# EAGLE design tenacity_pcb (EAGLE 9.6.2)
REV: p1; TITLE: Elemental Tenacity
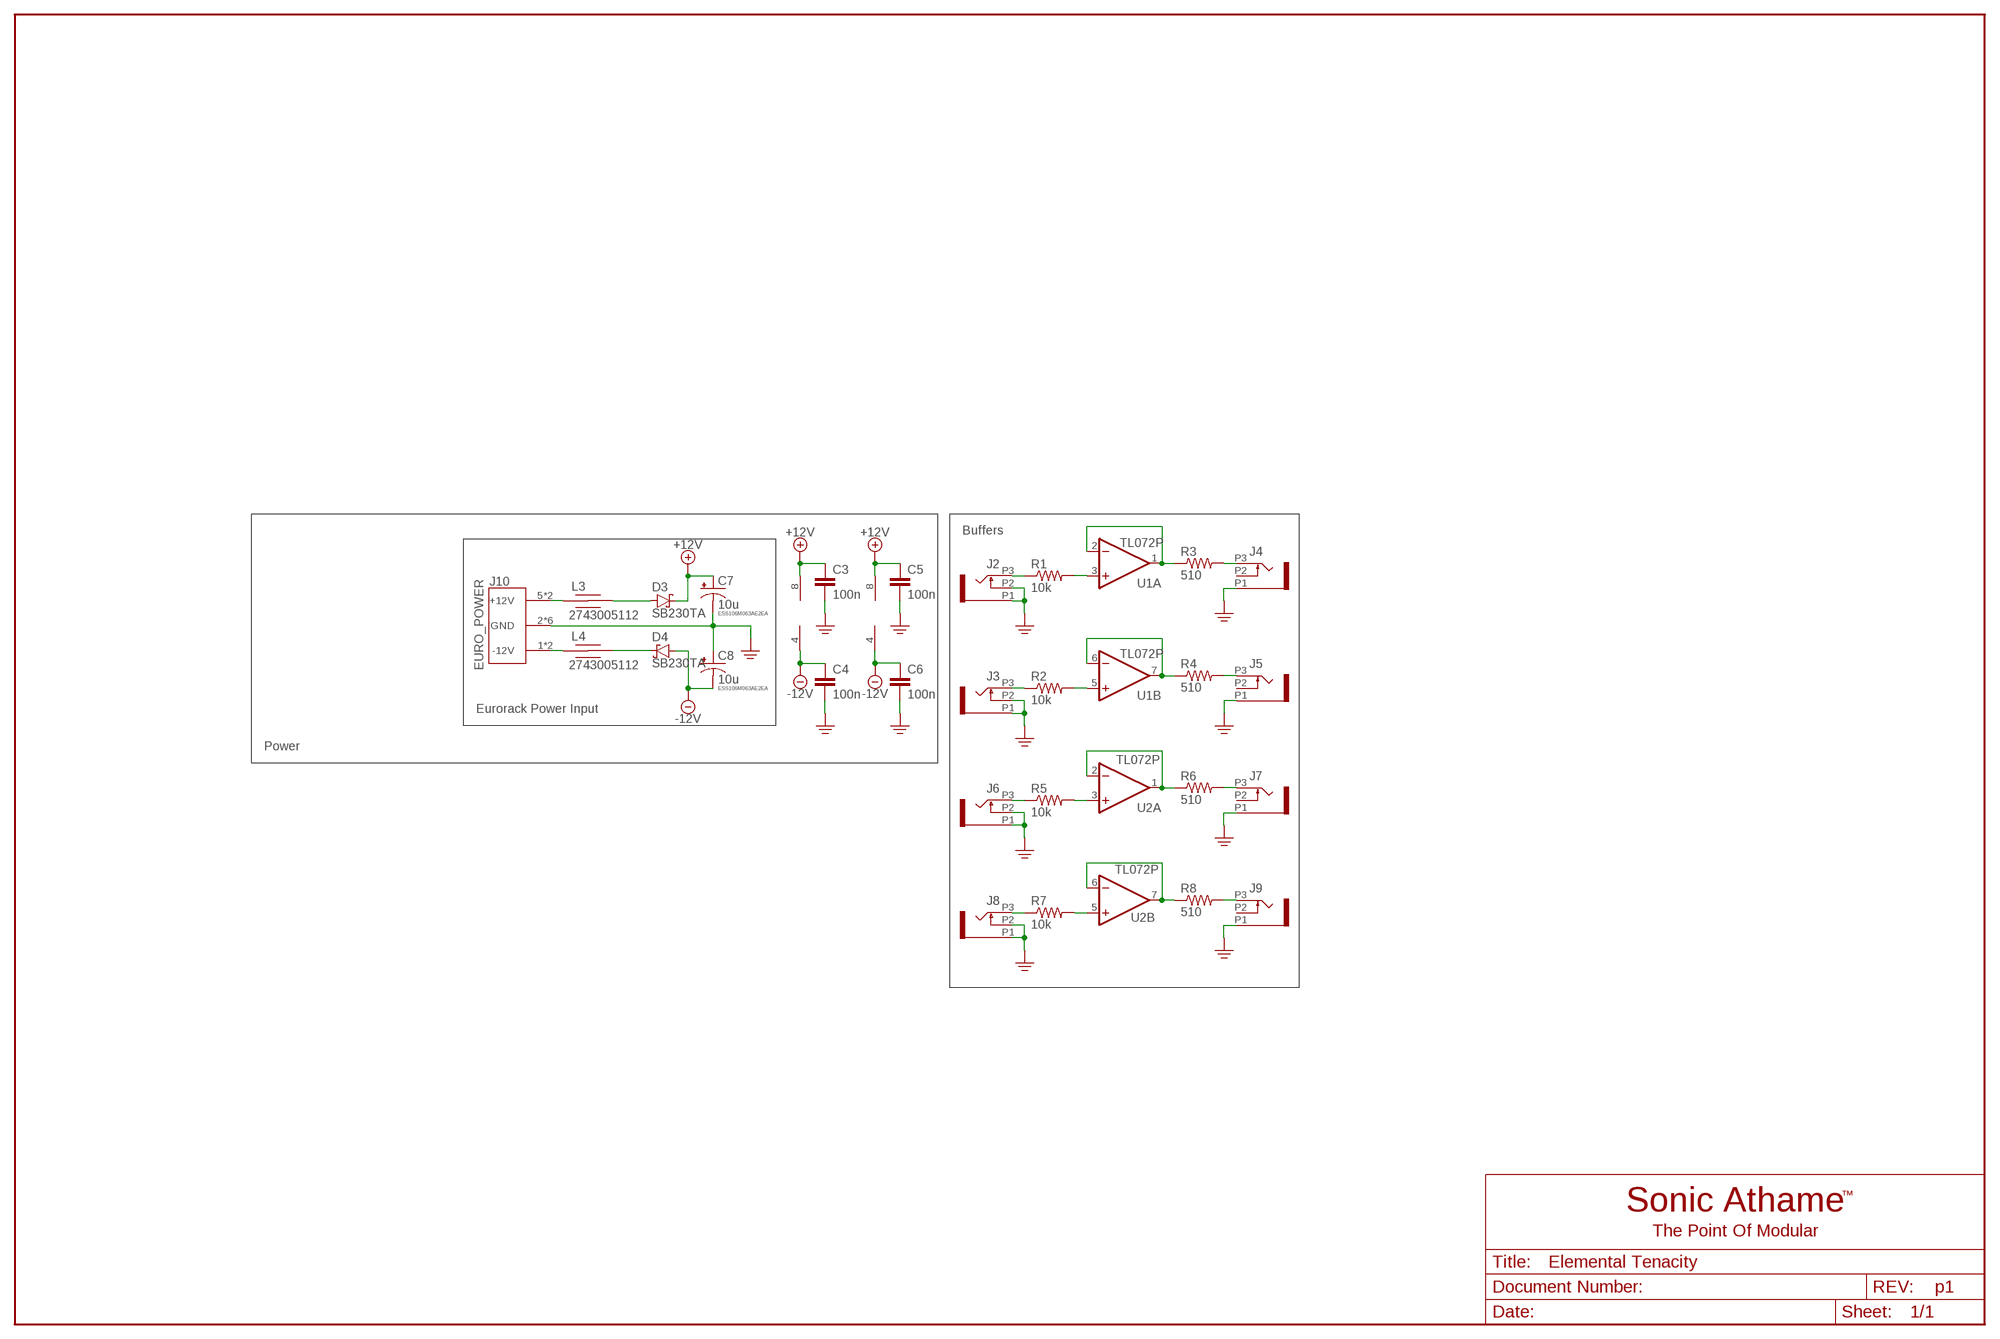
[diagram p0: schematic, sheet 1]

## Parts
C3  100n  CAP_NONPOL025-024X044  [C025-024X044]
C4  100n  CAP_NONPOL025-024X044  [C025-024X044]
C5  100n  CAP_NONPOL025-024X044  [C025-024X044]
C6  100n  CAP_NONPOL025-024X044  [C025-024X044]
C7  10u  CAP_POLLYTIC_V  [TT2D5]
C8  10u  CAP_POLLYTIC_V  [TT2D5]
D3  SB230TA  SCHOTTKY_THT  [0207/2V-POL]
D4  SB230TA  SCHOTTKY_THT  [0207/2V-POL]
J2  WQP-PJ398SM6  [WQP_PJ_301M6]
J3  WQP-PJ398SM6  [WQP_PJ_301M6]
J4  WQP-PJ398SM6  [WQP_PJ_301M6]
J5  WQP-PJ398SM6  [WQP_PJ_301M6]
J6  WQP-PJ398SM6  [WQP_PJ_301M6]
J7  WQP-PJ398SM6  [WQP_PJ_301M6]
J8  WQP-PJ398SM6  [WQP_PJ_301M6]
J9  WQP-PJ398SM6  [WQP_PJ_301M6]
J10  EURO_POWER  [EURO_POWER]
L3  2743005112  FERRITE_THT  [0207/2V]
L4  2743005112  FERRITE_THT  [0207/2V]
R1  10k  RESISTOR0207/2V  [0207/2V]
R2  10k  RESISTOR0207/2V  [0207/2V]
R3  510  RESISTOR0207/2V  [0207/2V]
R4  510  RESISTOR0207/2V  [0207/2V]
R5  10k  RESISTOR0207/2V  [0207/2V]
R6  510  RESISTOR0207/2V  [0207/2V]
R7  10k  RESISTOR0207/2V  [0207/2V]
R8  510  RESISTOR0207/2V  [0207/2V]
U1  TL072P  [DIL08]
U2  TL072P  [DIL08]

## Nets
+12V: C3.1 C5.1 C7.+ D3.C U1.8(P:V+) U2.8(P:V+)
-12V: C4.1 C6.1 C8.- D4.A U1.4(P:V-) U2.4(P:V-)
GND: C3.2 C4.2 C5.2 C6.2 C7.- C8.+ J2.P1 J2.P2 J3.P1 J3.P2 J4.P1 J5.P1 J6.P1 J6.P2 J7.P1 J8.P1 J8.P2 J9.P1 J10.2(GND) J10.3(GND) J10.4(GND) J10.7(GND) J10.8(GND) J10.9(GND)
N$1: J8.P3 R7.1
N$2: R7.2 U2.5(B:+IN)
N$3: R1.2 U1.3(A:+IN)
N$4: J2.P3 R1.1
N$5: J5.P3 R4.2
N$6: J4.P3 R3.2
N$7: R2.2 U1.5(B:+IN)
N$8: J9.P3 R8.2
N$9: J7.P3 R6.2
N$10: R4.1 U1.6(B:-IN) U1.7(B:OUT)
N$11: J3.P3 R2.1
N$12: R3.1 U1.1(A:OUT) U1.2(A:-IN)
N$13: R8.1 U2.6(B:-IN) U2.7(B:OUT)
N$14: J6.P3 R5.1
N$15: R5.2 U2.3(A:+IN)
N$16: R6.1 U2.1(A:OUT) U2.2(A:-IN)
N$21: D3.A L3.2
N$22: D4.C L4.2
N$23: J10.1(-12V) J10.10(-12V) L4.1
N$24: J10.5(+12V) J10.6(+12V) L3.1
Unconnected: J4.P2 J5.P2 J7.P2 J9.P2

## Notes on the sheet
- Buffers
- ESS106M063AE2EA
- ESS106M063AE2EA
- Eurorack Power Input
- Power

## Library data of the parts
C3-C6 = SonicAthame:CAP_NONPOL: CAPACITOR, European symbol; SPICEPREFIX: C
C7 C8 = SonicAthame:CAP_POL: POLARIZED CAPACITOR, American symbol
D3 D4 = SonicAthame:SCHOTTKY: THT: SB230TA
J2-J9 = SonicAthame:WQP-PJ398SM
J10 = SonicAthame:EURO_POWER
L3 L4 = SonicAthame:FERRITE
R1-R8 = SonicAthame:RESISTOR: RESISTOR, American symbol; SPICEPREFIX: R
U1 U2 = SonicAthame:TL072: OP AMP

## Board
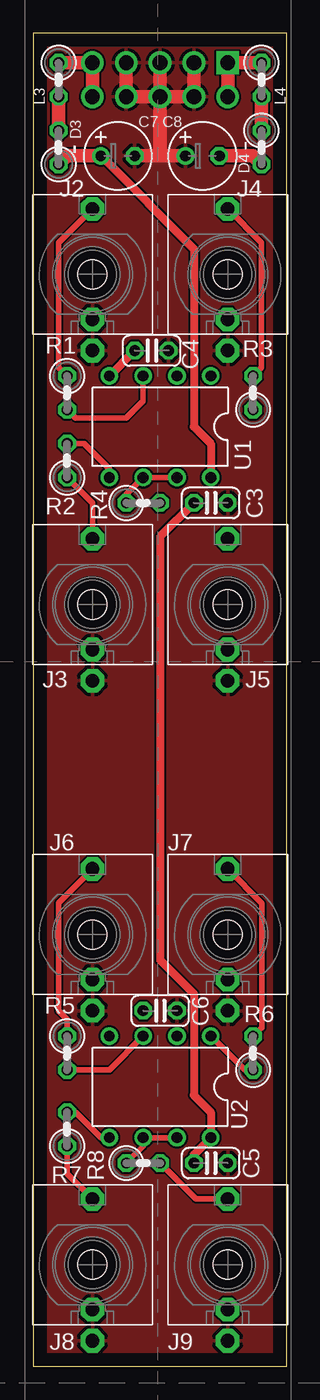
[diagram p1: board, top side]
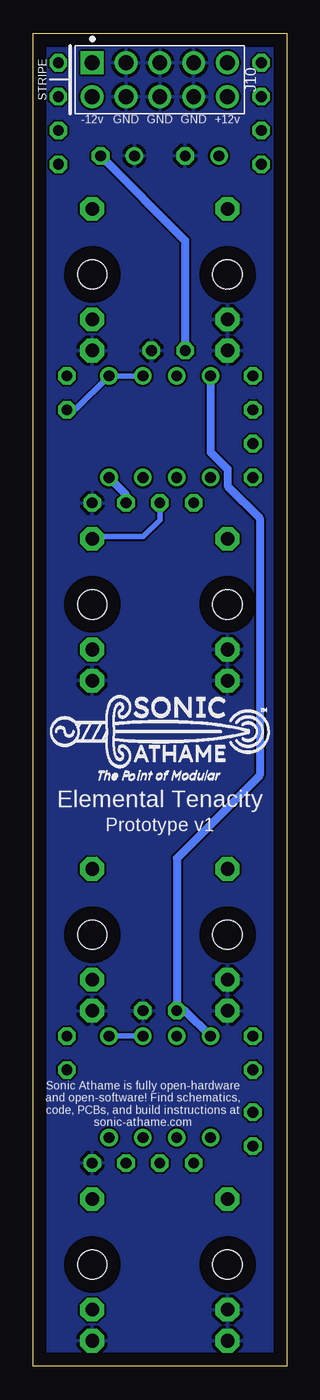
[diagram p2: board, bottom side, seen from below]

Size 19.03 x 100 mm. Coordinates in mm from the lower left corner, seen from the top.
Outline: 0,0 19.03,0 19.03,100 0,100 0,0
Copper layers (1*16): Top 0.035mm / dielectric 1.5mm / Bottom 0.035mm
Design rules "default": minimum track width 6mil, minimum drill 0.35mm, track to track 6mil, track to pad 6mil, pad to pad 6mil, via to via 6mil, smd to smd 6mil, copper to edge 40mil, drill to drill 6mil, minimum pad ring 10mil, minimum via ring 8mil, stop-mask expansion 4mil, vias tented up to drill 0mil, thermal gap 10mil

### Footprints (pad centres in the part's own frame; a part is rotated, then mirrored left to right if it is on the bottom)
C025-024X044 = drill 0.813 octagon: 1 -1.27,0; 2 1.27,0
TT2D5 = drill 0.813: + -1.27,0 | drill 0.813 octagon: - 1.27,0
0207/2V-POL = drill 0.813 octagon: A 1.27,0; C -1.27,0
WQP_PJ_301M6 = drill 1.016 pad 1.778 octagon: P1 0,-5.715; P2 0,-3.38; P3 0,4.92 | hole 2.2: 0,0
EURO_POWER = drill 1.105 pad 1.705 square: 1 -5.08,1.27 | drill 1.105 pad 1.705: 2 -2.54,1.27; 3 0,1.27; 4 2.54,1.27; 5 5.08,1.27; 6 5.08,-1.27; 7 2.54,-1.27; 8 0,-1.27; 9 -2.54,-1.27; 10 -5.08,-1.27
0207/2V = drill 0.813 octagon: 1 -1.27,0; 2 1.27,0
DIL08 = drill 0.813 pad 1.27: 1 -3.81,-3.81; 2 -1.27,-3.81; 3 1.27,-3.81; 4 3.81,-3.81; 5 3.81,3.81; 6 1.27,3.81; 7 -1.27,3.81; 8 -3.81,3.81

### Placement (x,y rotation side)
C3  13.34,64.77 0 top
C4  8.89,76.2 0 top
C5  13.34,15.24 0 top
C6  9.53,26.67 0 top
C7  6.35,90.81 0 top
C8  12.7,90.81 0 top
D3  1.91,91.44 90 top
D4  17.14,91.44 270 top
J2  4.45,81.91 0 top
J3  4.45,57.15 0 top
J4  14.61,81.91 0 top
J5  14.61,57.15 0 top
J6  4.45,32.38 0 top
J7  14.61,32.38 0 top
J8  4.45,7.62 0 top
J9  14.61,7.62 0 top
J10  9.53,96.52 0 bottom
L3  1.91,96.52 270 top
L4  17.14,96.52 270 top
R1  2.54,73.03 270 top
R2  2.54,67.94 90 top
R3  16.51,73.03 90 top
R4  8.26,64.77 0 top
R5  2.54,23.49 270 top
R6  16.51,23.49 90 top
R7  2.54,17.78 90 top
R8  8.26,15.24 0 top
U1  9.53,70.49 180 top
U2  9.53,20.95 180 top
U$1  [PANEL_REF_4U]  -0.64,-11.43 0 top  (outside the outline)
U$2  [LOGO-65MIL-BSILK]  9.53,47.62 0 top

### Tracks (layer width: path | path; a pad name or v marks a point on that pad's centre or on a via)
+12V
  Top 0.61: U1.8 13.34,69.22 12.06,70.49 12.06,83.82 C7.+ | C5.1 12.06,15.88 U2.8 13.34,19.05 12.06,20.32 12.06,27.94 9.53,30.48 9.53,62.23 C3.1
  Top 1.016: D3.C 2.54,90.81 C7.+
  Bottom 0.61: C3.1 12.06,65.41 U1.8
-12V
  Top 0.61: U1.4 C4.1
  Top 1.016: D4.A 16.51,90.81 C8.-
  Bottom 0.61: U2.4 7.62,26.67 C6.1 8.26,38.1 2.02,44.33 2.02,63.62 4.45,66.04 4.45,67.31 5.71,68.58 U1.4 | C8.- 7.62,84.46 C4.1
GND
  Top 1.016: J10.4 J10.7 J10.8 | J10.2 J10.9 J10.8 | J10.3 J10.8 | J10.8 9.53,90.81 | 9.53,90.81 C8.+ | C7.- 9.53,90.81
  pour Bottom: 0,-3.17 19.05,-3.17 19.05,100.33 0,100.33
  pour Top: 0,-1.9 19.05,-1.9 19.05,100.33 0,100.33
N$1
  Top 0.406: J8.P3 2.54,14.45 R7.1
N$2
  Top 0.406: U2.5 5.08,17.14 3.17,19.05 R7.2
N$3
  Top 0.406: R1.2 3.17,71.12 6.99,71.12 8.26,72.39 U1.3
N$4
  Top 0.406: R1.1 1.91,74.93 1.91,84.29 J2.P3
N$5
  Bottom 0.406: J5.P3 14.45,62.23 10.79,62.23 9.53,63.5 R4.2
N$6
  Top 0.406: R3.2 17.14,74.93 17.14,84.29 J4.P3
N$7
  Top 0.406: U1.5 5.71,67.31 3.81,69.22 R2.2
N$8
  Top 0.406: J9.P3 12.22,12.54 R8.2
N$9
  Top 0.406: R6.2 17.14,25.4 17.18,25.4 17.18,34.73 J7.P3
N$10
  Top 0.406: R4.1 6.99,65.41 U1.6 U1.7
N$11
  Top 0.406: J3.P3 4.45,64.77 R2.1
N$12
  Bottom 0.406: U1.2 U1.1 15.88,71.75 R3.1
N$13
  Top 0.406: U2.7 U2.6 8.26,16.51 R8.1
N$14
  Top 0.406: R5.1 2.54,26.04 1.91,26.67 1.91,34.77 J6.P3
N$15
  Top 0.406: R5.2 5.71,22.23 U2.3
N$16
  Top 0.406: R6.1 15.88,22.23 U2.1
  Bottom 0.406: U2.1 U2.2
N$21
  Top 1.016: L3.2 D3.A
N$22
  Top 1.016: L4.2 D4.C
N$23
  Top 1.016: J10.10 J10.1 L4.1
N$24
  Top 1.016: J10.6 J10.5 L3.1

### Text on the board
bNames: STRIPE | Elemental Tenacity | Prototype v1 | Sonic Athame is fully open-hardware / and open-software! Find schematics, / code, PCBs, and build instructions at / sonic-athame.com